# EasyEDA Pro project ProPrj_#第十届立创电赛#第十届立创电赛-小智AI立创开发板_2025-12-12.epro

# Schematic Schematic1_2
Board Name: 1、R16N8基本对话板 v1.1; Create Date: 2025-08-15; Page Name: P1; Project Name: 25.05 ESP32小智AI设备; Schematic Name: Schematic1_1; Update Date: 2025-08-18; Company: 嘉立创EDA; Page Size: A4; Version: V1.0
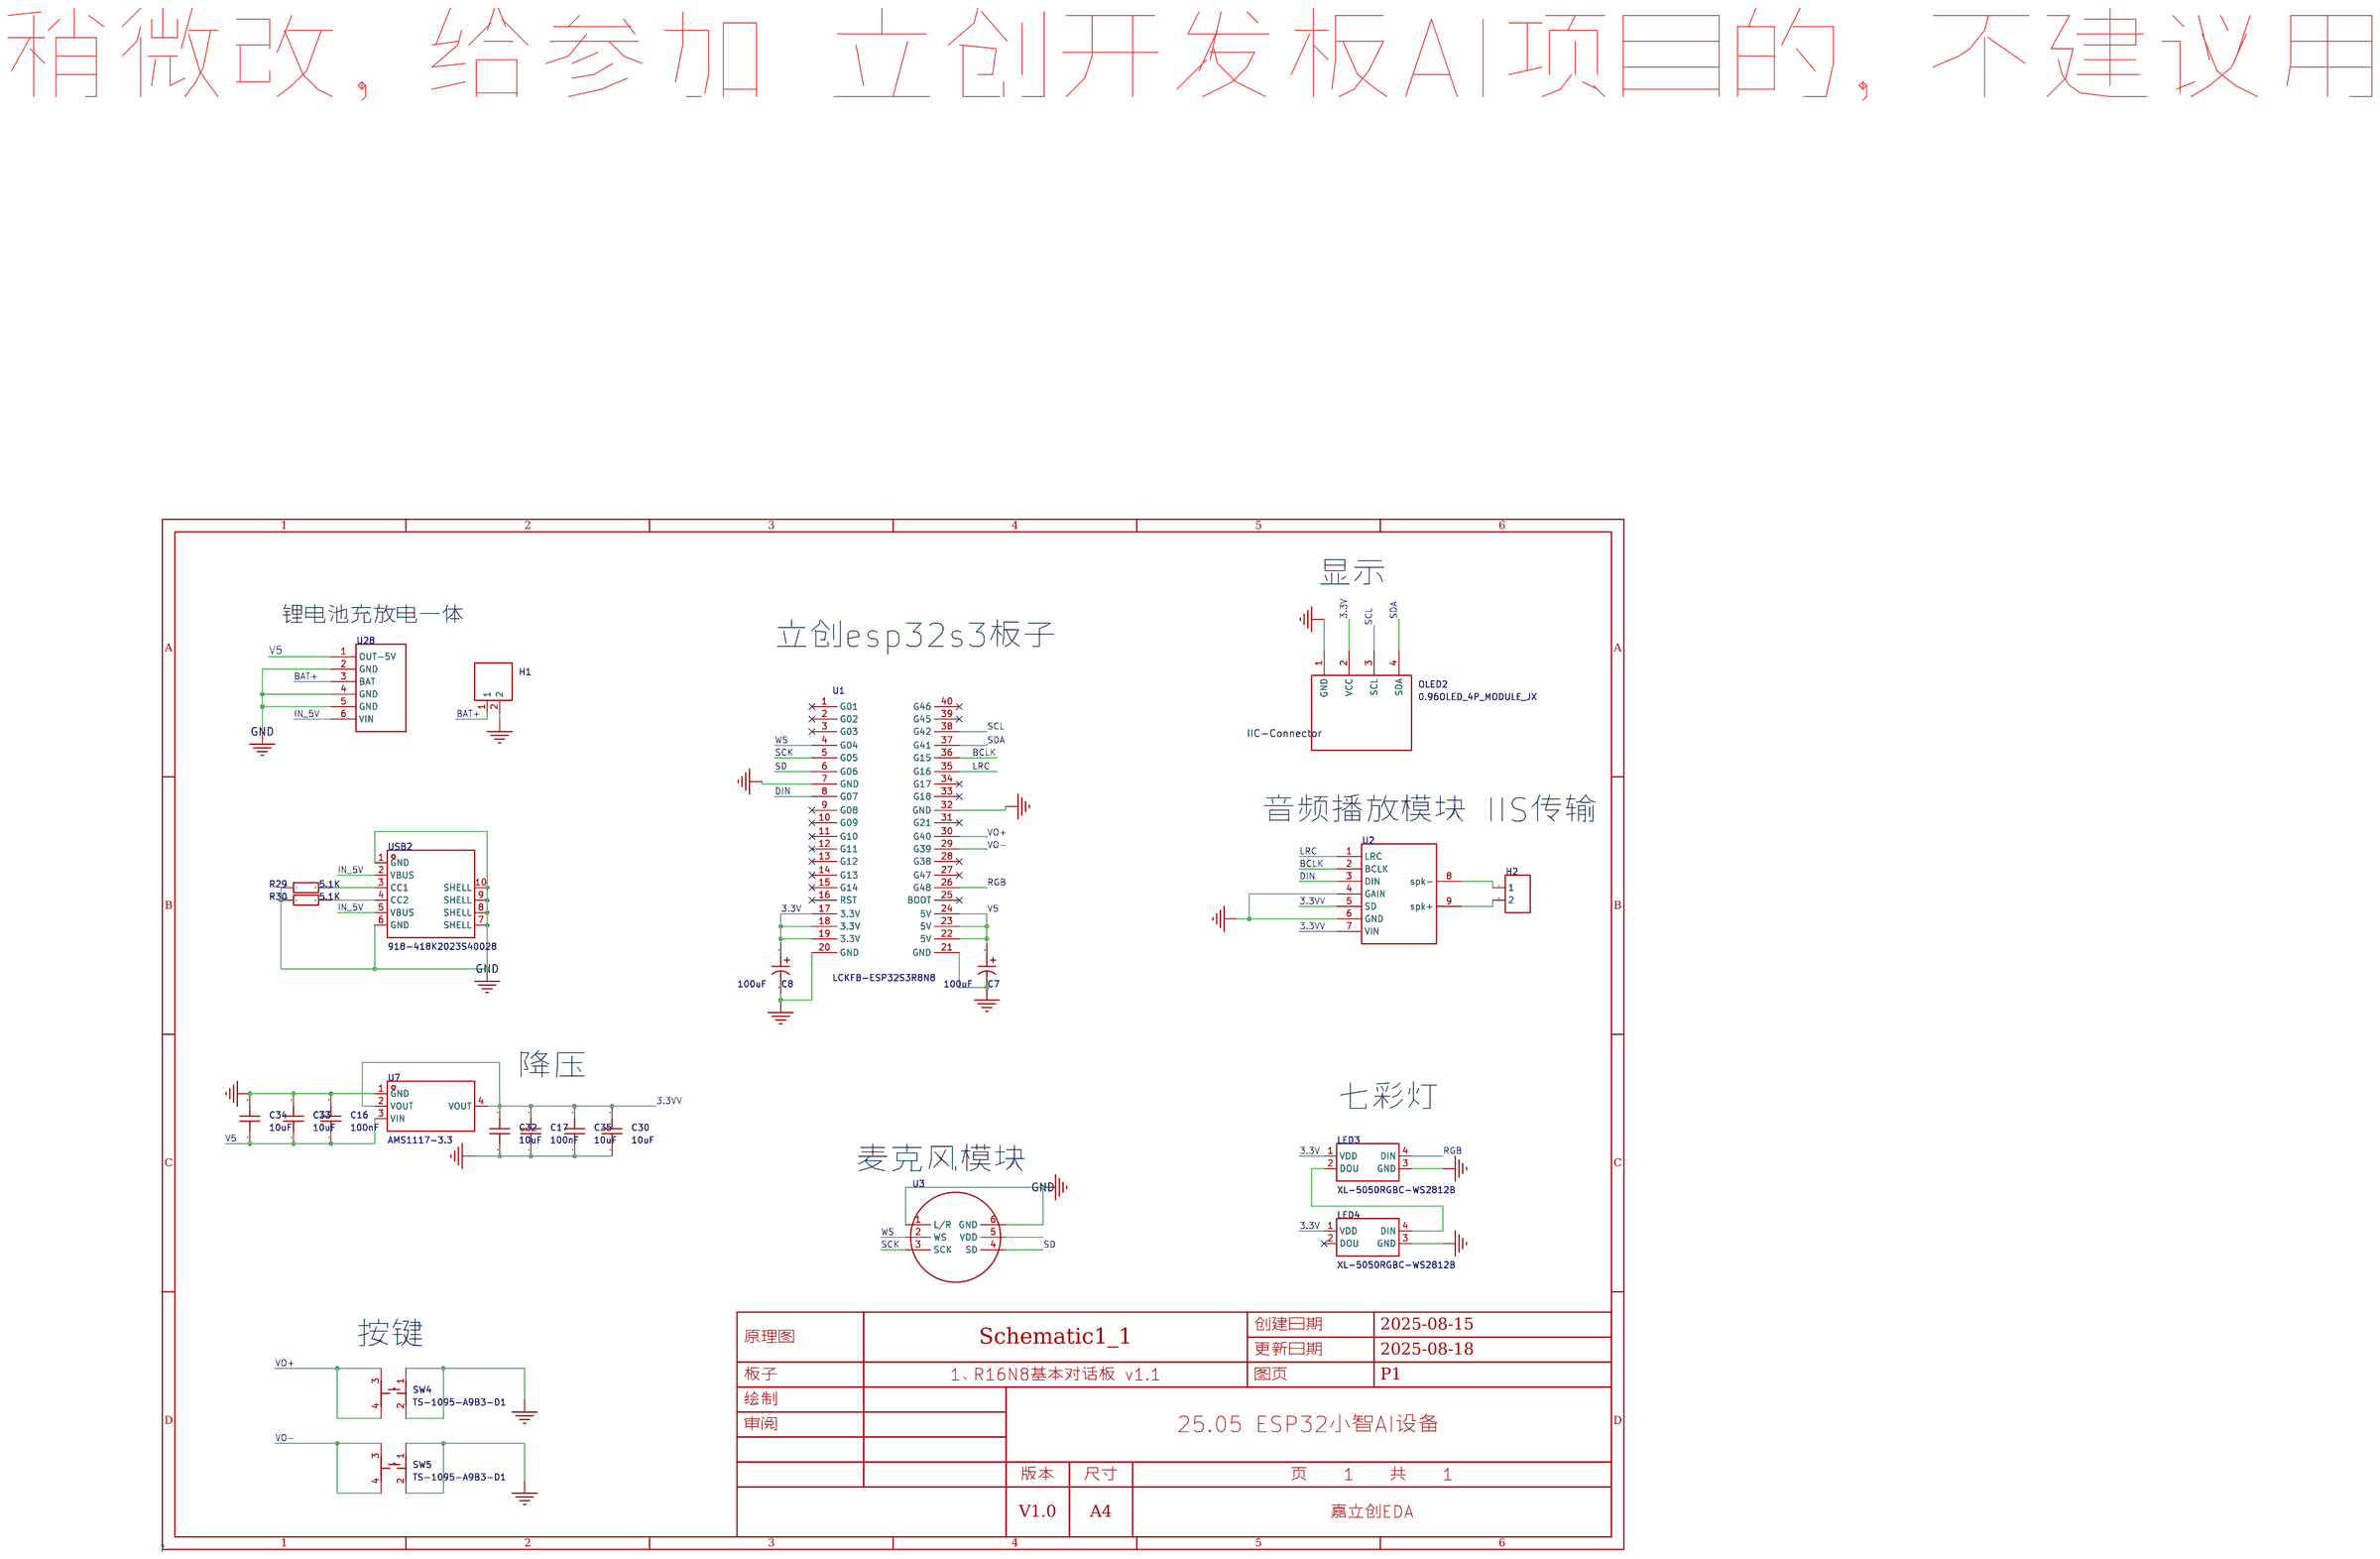
[diagram p0: schematic sheet]

## Parts
C7  100uF  [CAP-SMD_BD6.3-L6.6-W6.6-LS7.6-RD]
C8  100uF  [CAP-SMD_BD6.3-L6.6-W6.6-LS7.6-RD]
C16  100nF  [C0603]
C17  100nF  [C0603]
C30  10uF  [C0603]
C32  10uF  [C0603]
C33  10uF  [C0603]
C34  10uF  [C0603]
C35  10uF  [C0603]
H1  B-2100S02P-A110  [HDR-TH_2P-P2.54-V-M-1]
H2  -  [HDR-TH_2P-P2.54-V-F]
LED3  XL-5050RGBC-WS2812B  [LED-SMD_4P-L5.0-W5.0-BL_XL-5050RGBC]
LED4  XL-5050RGBC-WS2812B  [LED-SMD_4P-L5.0-W5.0-BL_XL-5050RGBC]
OLED2  0.96OLED_4P_MODULE_JX  [0.96OLED_4P]
R29  5.1K  [R0603]
R30  5.1K  [R0603]
SW4  TS-1095-A9B3-D1  [SW-TH_4P-L6.0-W6.0-P4.50-LS6.5]
SW5  TS-1095-A9B3-D1  [SW-TH_4P-L6.0-W6.0-P4.50-LS6.5]
U1  LCKFB-ESP32S3R8N8  [DIP-40_L20.32-W51.66-P2.54-LS15.24]
U2  -  [max98357a]
U3  -  [inmp441]
U7  AMS1117-3.3  [SOT-223-3_L6.5-W3.4-P2.30-LS7.0-BR]
U28  -  [MH-CD42_Module]
USB2  918-418K2023S40028  [USB-C-SMD_918-418K2023S40026]

## Library data of the parts
C7 C8 = RVT1H101M0607: 容值:100uF;精度:±20%;额定电压:50V;纹波电流:229mA@120Hz;; LCSC Part Name: 100uF ±20% 50V; Supplier Part: C3151829; Manufacturer: ROQANG(容强); Supplier Footprint: SMD,D6.3xL7.7mm; JLCPCB Part Class: 扩展库; Datasheet: https://atta.szlcsc.com/upload/public/pdf/source/20170325/1490427950282.pdf; Supplier: LCSC; Tolerance: ±20%; Rated Voltage: 50V; Ripple Current: 229mA@120Hz; φD: 6.3mm; L: 7.7mm; Lifetime @ Temp: 2000hrs@105℃; Operating Temperature: -40℃~+105℃
C16 C17 C30 C32-C35 = CAP_0603: Supplier Footprint: 0603
H1 = B-2100S02P-A110: 插针结构:1x2P;间距:2.54mm;行距:-;圆针/方针:-;安装方式:直插;排数:单排;总PIN位数:2P;额定电流:-;额定电压:-;配合针长度:6mm;塑高:2.54mm;端接针长度:3mm;触头材质:黄铜;触头镀层:-;工作温度:-40℃~+105℃;颜色:黑色;; LCSC Part Name: 1x2P 间距:2.54mm 直插; Supplier Part: C124375; Manufacturer: Ckmtw(灿科盟); Supplier Footprint: 插件,P=2.54mm; JLCPCB Part Class: Extended Part; Datasheet: https://atta.szlcsc.com/upload/public/pdf/source/20221019/2EE72DAC61CAA62C0A53546E211F9C15.pdf; Supplier: LCSC; Pin Structure: 1x2P; Pitch: 2.54mm; Mounting Type: 直插; Number of Rows: 单排; Number of Pins: 2P; Length of Mating Pin: 6mm; Insulation Height: 2.54mm; Length of End Connection Pin: 3mm; Contact Material: 黄铜; Operating Temperature: -40℃~+105℃; Color: 黑色
H2 = HDR-F_2.54_1x2P: Supplier Part: C49661; Supplier Footprint: 插件
LED3 LED4 = XL-5050RGBC-WS2812B: 5050七彩幻彩透明贴片LED灯珠 5050 幻彩透明四脚 ws2812B 内置驱动IC; Supplier Part: C2843785; Manufacturer: XINGLIGHT(成兴光); Supplier Footprint: SMD5050; JLCPCB Part Class: Extended Part; Datasheet: https://atta.szlcsc.com/upload/public/pdf/source/20240412/E1004CAA80592E31D08BFE019083806F.pdf; Supplier: LCSC
OLED2 = 0.96OLED_4P_MODULE_JX: Supplier Part: C9900004566; Supplier Footprint: 插件; JLCPCB Part Class: 扩展库; Supplier: LCSC
R29 R30 = Res_0603: Supplier Footprint: 0603
SW4 SW5 = TS-1095-A9B3-D1: 电路结构:单刀单掷;按钮形状:圆形按钮;安装方式:-;开关长度:6mm;开关宽度:6mm;开关高度:8mm;带灯:-;机械寿命:-;; LCSC Part Name: 轻触开关6*6*8.0mm插件四脚DIP圆柄黑柄250gf; Supplier Part: C493050; Manufacturer: Yuandi(元迪); JLCPCB Part Class: Extended Part; Datasheet: https://atta.szlcsc.com/upload/public/pdf/source/20200316/C493031_978ABBAA7BB5FD73504C6B696B546505.pdf; Supplier: LCSC; Circuit: 单刀单掷; Actuator Style: 圆形按钮; Switch Length: 6mm; Switch Width: 6mm; Switch Height: 8mm
U1 = LCKFB-ESP32S3R8N8: LCSC Part Name: 立创·ESP32S3R8N8 开发板; Supplier Part: C20626143; Manufacturer: 立创开发板; JLCPCB Part Class: Extended Part; Datasheet: https://atta.szlcsc.com/upload/public/pdf/source/20241206/8BAF30E9665AF2DA28B66306BACEE9A0.pdf; Supplier: LCSC
U2 = MAX98357A: MAX98357A I2S音频放大器模块
U3 = INMP441: INMP441 全向麦克风模块
U7 = AMS1117-3.3_C6186: 输出类型:固定;最大输入电压:-;输出电压:3.3V;最大输出电流:1A;电源纹波抑制比(PSRR):72dB@(120Hz);输出极性:正极;; LCSC Part Name: 输出3.3V 1A; Supplier Part: C6186; Manufacturer: AMS; Supplier Footprint: SOT-223; JLCPCB Part Class: 基础库; Datasheet: https://atta.szlcsc.com/upload/public/pdf/source/20180727/C6186_7A095716F0823C02F1997A905E26C086.pdf; Supplier: LCSC; Output Type: 固定; Output Voltage: 3.3V; MAX Output Current: 1A; Power Supply Rejection Ratio (PSRR): 72dB@(120Hz); Dropout Voltage: 1.3V@(800mA); Output Polarity: 正极; Number of Outputs: 1
U28 = mh-cd42: 5V/2A锂电池充放电一体模块，但按键、4led电量指示灯
USB2 = 918-418K2023S40028: 连接器类型:Type-C;标准:USB 3.1;公母:母;安装方式:卧贴;触点数量:6P;端口数量:1;额定电流 - 电源:-;工作温度范围:-25℃~+85℃;; LCSC Part Name: Type-C 母 卧贴 停产 停产; Supplier Part: C2763105; Manufacturer: 精拓金; Supplier Footprint: SMD; JLCPCB Part Class: 扩展库; Datasheet: https://atta.szlcsc.com/upload/public/pdf/source/20210526/C2763105_D24CC3EF9A00F9BD117EFBA5548A7E17.pdf; Supplier: LCSC; Connector Type: Type-C; Standard: USB 3.1; Gender: 母; Mounting Style: 卧贴; Number of Contacts: 6P; Number of Ports: 1; Operating Temperature Range: -25℃~+85℃

## Nets
3.3V: C8.1 LED3.1(VDD) LED4.1(VDD) OLED2.2(VCC) U1.17(3.3V) U1.18(3.3V) U1.19(3.3V)
3.3VV: C17.2 C30.2 C32.2 C35.2 U2.5(SD) U2.7(VIN) U7.2(VOUT) U7.4(VOUT)
GND: C7.2 C8.2 C16.2 C17.1 C30.1 C32.1 C33.2 C34.2 C35.1 H1.2 LED3.3(GND) LED4.3(GND) OLED2.1(GND) R29.1 R30.1 SW4.1 SW4.2 SW5.1 SW5.2 U1.7(GND) U1.20(GND) U1.21(GND) U1.32(GND) U2.4(GAIN) U2.6(GND) U3.1(L/R) U3.6(GND) U7.1(GND) U28.2(GND) U28.4(GND) U28.5(GND) USB2.1(GND) USB2.6(GND) USB2.7(SHELL) USB2.8(SHELL) USB2.9(SHELL) USB2.10(SHELL)
V5: C7.1 C16.1 C33.1 C34.1 U1.22(5V) U1.23(5V) U1.24(5V) U7.3(VIN) U28.1(OUT-5V)
BAT+: H1.1 U28.3(BAT)
BCLK: U1.36(G15) U2.2(BCLK)
DIN: U1.8(G07) U2.3(DIN)
IN_5V: U28.6(VIN) USB2.2(VBUS) USB2.5(VBUS)
LRC: U1.35(G16) U2.1(LRC)
RGB: LED3.4(DIN) U1.26(G48)
SCK: U1.5(G05) U3.3(SCK)
SCL: OLED2.3(SCL) U1.38(G42)
SD: U1.6(G06) U3.4(SD)
SDA: OLED2.4(SDA) U1.37(G41)
VO+: SW4.3 SW4.4 U1.30(G40)
VO-: SW5.3 SW5.4 U1.29(G39)
WS: U1.4(G04) U3.2(WS)
$1N4065: LED3.2(DOU) LED4.4(DIN)
$1N9820: R29.2 USB2.3(CC1)
$1N9821: R30.2 USB2.4(CC2)
$1N10523: H2.1 U2.8(spk-)
$1N10529: H2.2 U2.9(spk+)

Not connected (* = marked no-connect by the designer): LED4 2(DOU)*; U1 1(G01)* 2(G02)* 3(G03)* 9(G08)* 10(G09)* 11(G10)* 12(G11)* 13(G12)* 14(G13)* 15(G14)* 16(RST)* 25(BOOT)* 27(G47)* 28(G38)* 31(G21)* 33(G18)* 34(G17)* 39(G45)* 40(G46)*; U3 5(VDD)

## Notes on the sheet
- 稍微改，给参加 立创开发板AI项目的，不建议用
- 显示
- 锂电池充放电一体
- 立创esp32s3板子
- 音频播放模块 IIS传输
- 降压
- 七彩灯
- 麦克风模块
- 按键

# Board PCB-1.1_1
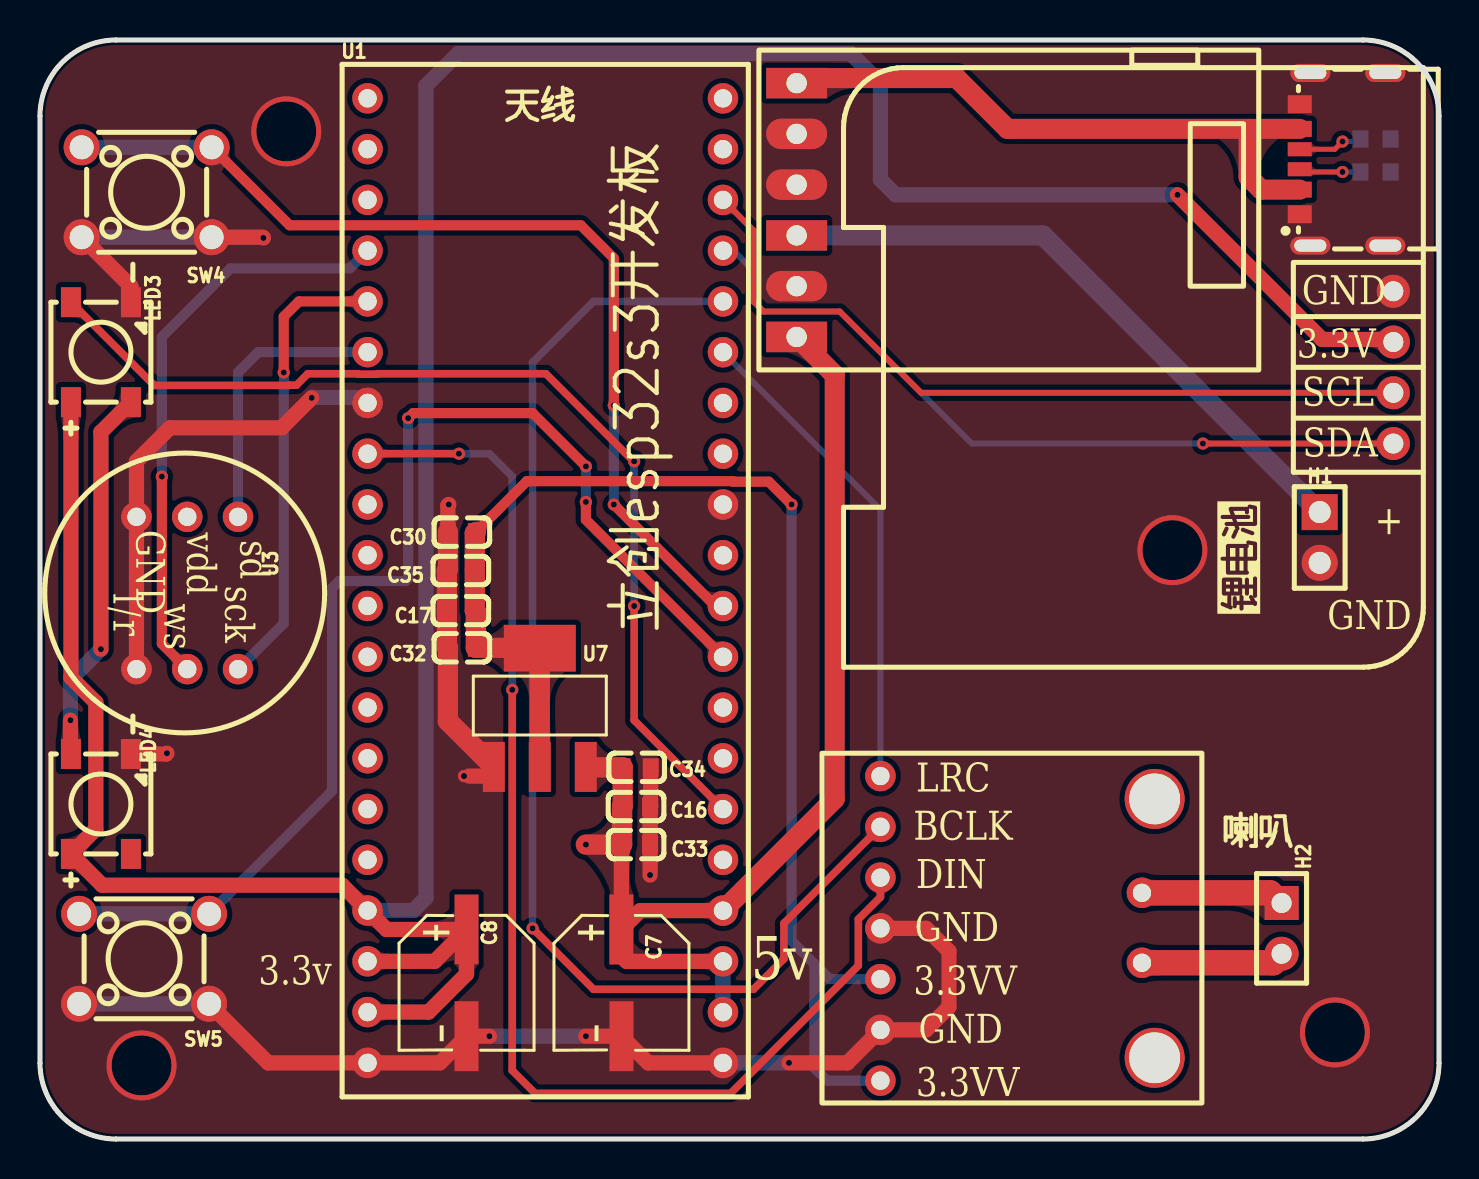
[diagram p1: board, top side]
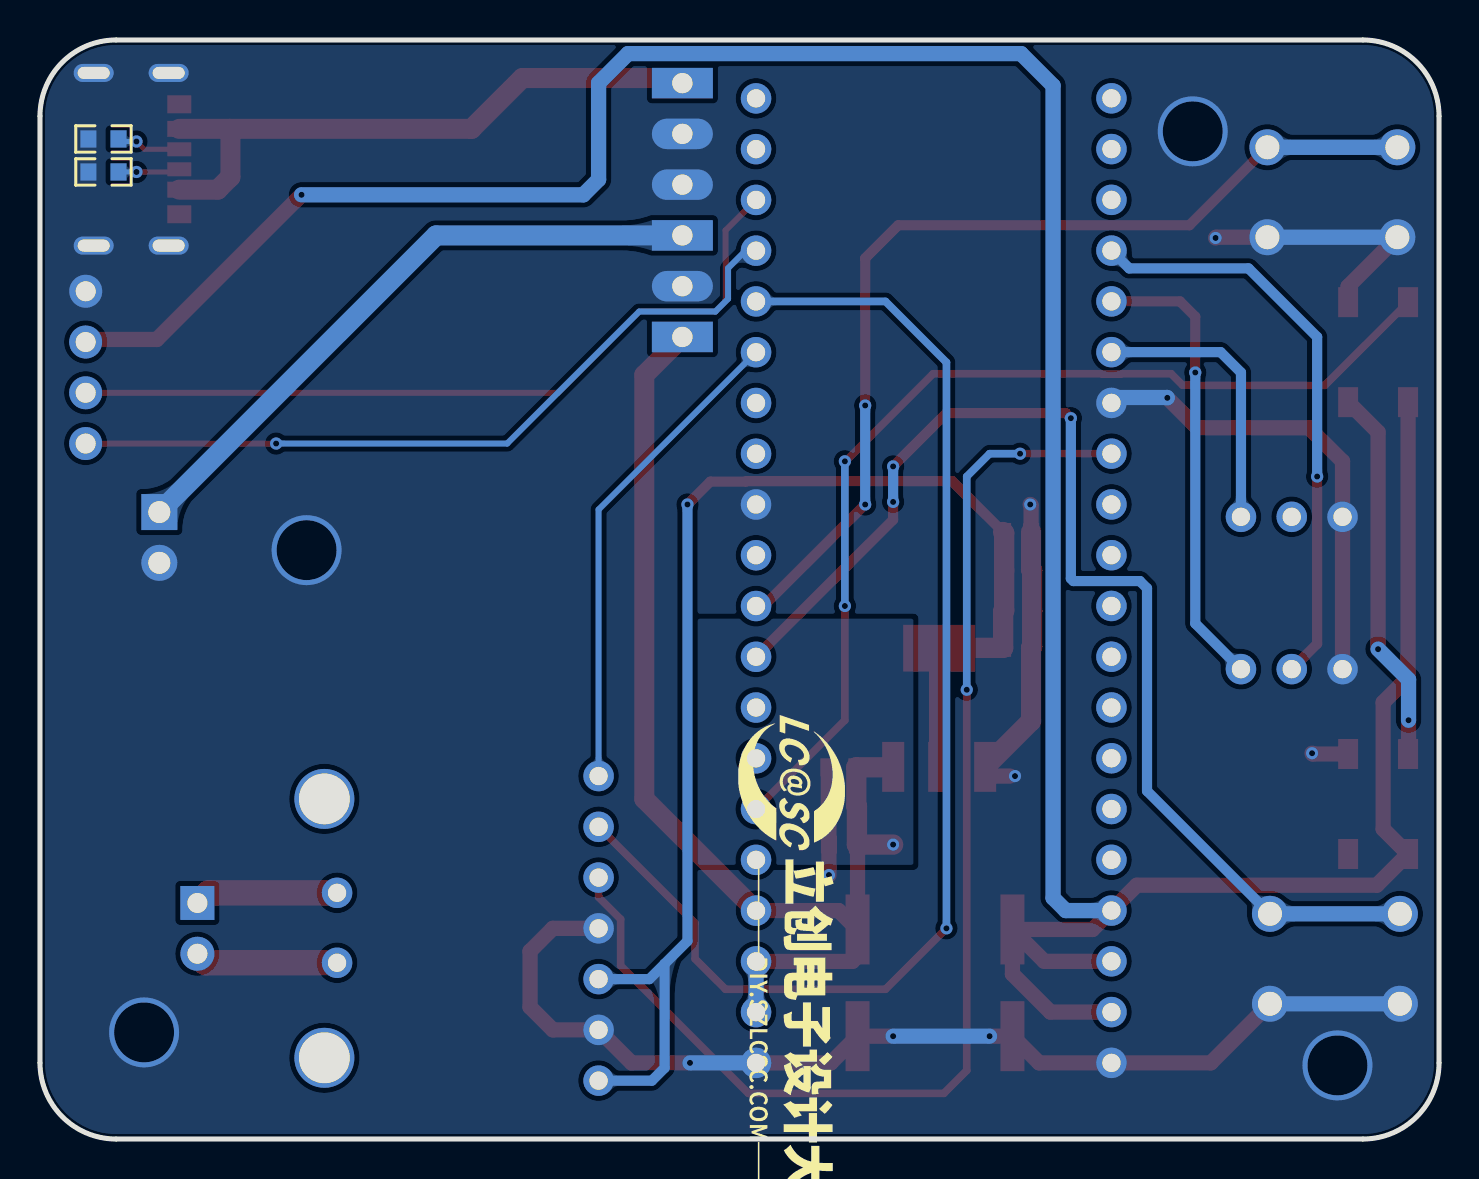
[diagram p2: board, bottom side, seen from below]

Outline 69.98 x 54.99 mm; copper layers: Top Layer, Bottom Layer. Coordinates in mm from the lower left corner of the outline.
Outline path: 0,51.18 0,3.81 arc(1.12,1.12) 3.81,0 66.17,0 arc(68.86,1.12) 69.98,3.81 69.98,51.18 arc(68.86,53.88) 66.17,54.99 3.81,54.99 arc(1.12,53.88) 0,51.18
Stack: Top Layer 0.035mm / Dielectric1 1.51mm FR4 er 4.5 / Bottom Layer 0.035mm

## Design rules (mm)
spacing copperThickness1oz (default): track to track 0.102, other pairs 0.152 to 0.3
spacing copperThickness2oz: track to track 0.203, other pairs 0.152 to 0.3
spacing Plane_innerPlane: track to track 0.102, other pairs 0.152 to 0.3
spacing Copper_copperRegion: track to track 0.102, other pairs 0.152 to 0.3
spacing Copper_copperRegion1: track to track 0.102, other pairs 0.152 to 0.3
track width copperThickness1oz (default): min 0.127, default 0.254, max 2.54
track width copperThickness2oz: min 0.203, default 0.254, max 2.54
differential pair differentialPair (default): width min 0.127, default 0.254, max 2.54; gap min 0.152, default 0.152

## Placement (name value [footprint] x y rotation side)
C7  100uF  [CAP-SMD_BD6.3-L6.6-W6.6-LS7.6-RD]  29.08 7.81 270 top
C8  100uF  [CAP-SMD_BD6.3-L6.6-W6.6-LS7.6-RD]  21.34 7.81 270 top
C16  100nF  [C0603]  29.81 16.64 0 top
C17  100nF  [C0603]  21.05 26.44 0 top
C30  10uF  [C0603]  21.1 30.37 0 top
C32  10uF  [C0603]  21.1 24.58 0 top
C33  10uF  [C0603]  29.81 14.73 0 top
C34  10uF  [C0603]  29.84 18.6 0 top
C35  10uF  [C0603]  21.05 28.45 0 top
H1  B-2100S02P-A110  [HDR-TH_2P-P2.54-V-M-1]  64.01 30.1 270 top
H2  -  [HDR-TH_2P-P2.54-V-F]  62.1 10.54 270 top
LED3  XL-5050RGBC-WS2812B  [LED-SMD_4P-L5.0-W5.0-BL_XL-5050RGBC]  3.05 39.37 0 top
LED4  XL-5050RGBC-WS2812B  [LED-SMD_4P-L5.0-W5.0-BL_XL-5050RGBC]  3.05 16.76 0 top
OLED2  0.96OLED_4P_MODULE_JX  [0.96OLED_4P]  67.69 38.61 270 top
R29  5.1K  [R0603]  66.8 48.39 180 bottom
R30  5.1K  [R0603]  66.8 50.04 180 bottom
SW4  TS-1095-A9B3-D1  [SW-TH_4P-L6.0-W6.0-P4.50-LS6.5]  5.33 47.37 180 top
SW5  TS-1095-A9B3-D1  [SW-TH_4P-L6.0-W6.0-P4.50-LS6.5]  5.21 9.02 180 top
U1  LCKFB-ESP32S3R8N8  [DIP-40_L20.32-W51.66-P2.54-LS15.24]  25.27 27.94 0 top
U2  -  [max98357a]  111 -8.13 0 top
U3  -  [inmp441]  39.62 96.66 90 top
U7  AMS1117-3.3  [SOT-223-3_L6.5-W3.4-P2.30-LS7.0-BR]  25 21.59 270 top
U28  -  [MH-CD42_Module]  50.55 47.75 180 top
USB2  918-418K2023S40028  [USB-C-SMD_918-418K2023S40026]  65.15 49.02 90 top

## Footprints (pads in the part's own frame, mm; a bottom-side part is the same pattern mirrored in y, then rotated)
0.96OLED_4P
  round 1.65 hole 1: 1(-3.81,-0.002) 2(-1.27,0.002) 3(1.27,0.002) 4(3.81,0.002)
C0603
  rect 0.8x0.9 smd: 1(-0.7,0) 2(0.7,0)
CAP-SMD_BD6.3-L6.6-W6.6-LS7.6-RD
  rect 3.5x1.2 smd: 1(-2.67,0) 2(2.67,0)
DIP-40_L20.32-W51.66-P2.54-LS15.24
  round 1.524 hole 0.914: 1(-8.889,24.131) 2(-8.889,21.591) 3(-8.889,19.052) 4(-8.889,16.512) 5(-8.889,13.972) 6(-8.889,11.431) 7(-8.889,8.892) 8(-8.889,6.351) 9(-8.889,3.812) 10(-8.889,1.272) 11(-8.889,-1.268) 12(-8.889,-3.808) 13(-8.889,-6.348) 14(-8.889,-8.889) 15(-8.889,-11.428) 16(-8.889,-13.969) 17(-8.889,-16.509) 18(-8.889,-19.049) 19(-8.889,-21.588) 20(-8.889,-24.128) 21(8.889,-24.131) 22(8.889,-21.591) 23(8.889,-19.052) 24(8.889,-16.512) 25(8.889,-13.972) 26(8.889,-11.431) 27(8.889,-8.892) 28(8.889,-6.351) 29(8.889,-3.812) 30(8.889,-1.272) 31(8.889,1.268) 32(8.889,3.808) 33(8.889,6.348) 34(8.889,8.889) 35(8.889,11.428) 36(8.889,13.969) 37(8.889,16.509) 38(8.889,19.049) 39(8.889,21.588) 40(8.889,24.128)
HDR-TH_2P-P2.54-V-F
  rect 1.7x1.7 hole 1: 1(-1.27,0)
  round 1.7 hole 1: 2(1.27,0)
HDR-TH_2P-P2.54-V-M-1
  rect 1.8x1.8 hole 1.1: 1(-1.27,0)
  round 1.8 hole 1.1: 2(1.27,0)
inmp441
  round 1.524 hole 0.914: 1(-73.152,34.798) 2(-73.152,32.258) 3(-73.152,29.718) 4(-65.532,29.718) 5(-65.532,32.258) 6(-65.532,34.798)
LED-SMD_4P-L5.0-W5.0-BL_XL-5050RGBC
  rect 1x1.5 smd: 1(-1.5,-2.5) 2(1.5,-2.5) 3(1.5,2.5) 4(-1.5,2.5)
max98357a
  round 3 hole 2.54: (-55.245,25.146) (-55.245,12.192)
  round 1.524 hole 0.914: 1(-68.961,26.289) 2(-68.961,23.749) 3(-68.961,21.209) 4(-68.961,18.669) 5(-68.961,16.129) 6(-68.961,13.589) 7(-68.961,11.049) 8(-55.88,20.447) 9(-55.88,16.947)
MH-CD42_Module
  rect 3.048x1.524 hole 1.016: 1(12.7,7.62) 3(12.7,2.54) 6(12.7,-5.08)
  oval 3.048x1.524 hole 1.016: 2(12.7,5.08) 4(12.7,0) 5(12.7,-2.54)
R0603
  rect 0.806x0.864 smd: 1(-0.753,0) 2(0.753,0)
SOT-223-3_L6.5-W3.4-P2.30-LS7.0-BR
  rect 2.5x1.1 smd: 1(2.97,-2.3) 2(2.97,0) 3(2.97,2.3)
  rect 2.34x3.6 smd: 4(-2.97,0)
SW-TH_4P-L6.0-W6.0-P4.50-LS6.5
  round 1.8 hole 1.2: 1(-3.25,2.25) 2(3.25,2.25) 3(-3.25,-2.25) 4(3.25,-2.25)
USB-C-SMD_918-418K2023S40026
  rect 0.9x1.2 smd: 1(-2.75,2.14) 6(2.75,2.14)
  rect 0.8x1.2 smd: 2(-1.52,2.14) 5(1.52,2.14)
  rect 0.7x1.2 smd: 3(-0.5,2.14) 4(0.5,2.14)
  oval 0.9x2 hole 0.6x1.6: 7(4.32,1.61) 8(4.32,-2.14) 9(-4.32,-2.14) 10(-4.32,1.61)

## Nets
As in the schematic.

Pads without a net: LED4 2; U1 1 2 3 9 10 11 12 13 14 15 16 25 27 28 31 33 34 39 40

## Via types
v1: diameter 0.61, hole 0.305, Top Layer to Bottom Layer, 29 vias
v2: diameter 3.5, hole 3, Top Layer to Bottom Layer, 4 vias

## Routing (per net, layer and track width the routed paths; a pad name or vN(x,y) marks a point on that pad's centre or on a via; arc(x,y) is an arc through that point)
3.3V: length 160.3
  Top Layer w0.762: LED3.1 1.55,23.09 2.79,21.84 2.79,15.51 LED4.1 3.11,12.7 15.12,12.7 U1.17 17.33,10.48 C8.1 ; C8.1 19.74,8.89 U1.18 ; C8.1 21.34,8.25 19.43,6.35 U1.19 ; v1(56.9,47.24) 64.14,40 67.57,40 OLED2.2
  Bottom Layer w0.762: v1(56.9,47.24) 42.8,47.24 42.04,48.01 42.04,52.83 40.56,54.31 20.91,54.31 19.3,52.7 19.3,12.06 18.67,11.43 U1.17
3.3VV: length 68.2
  Top Layer w0.508: v1(37.59,31.75) 36.45,32.89 34.67,32.89 34.65,32.92 24.35,32.92 C30.2
  Top Layer w1.016: C30.2 21.75,30.32 C35.2 C17.2 21.8,26.39 C32.2 24.98,24.58 U7.4 U7.2
  Bottom Layer w0.508: U2.5 39.5,8 38.73,8.76 ; 38.73,8.76 37.59,9.91 v1(37.59,31.75) ; 38.73,8.76 38.73,3.56 39.37,2.92 U2.7
GND: length 113.3
  Top Layer w0.762: SW4.1 11.14,45.12 v1(11.18,45.08) ; U2.4 44.32,10.54 45.47,9.4 45.47,6.6 44.32,5.46 U2.6 40.39,3.81 v1(37.46,3.81) ; U1.21 30.42,3.81 C7.2 v1(27.3,5.14) ; 22.7,18.62 22.24,18.16 21.46,18.16 ; LED3.3 4.55,42.66 SW4.2 ; LED4.3 6.31,19.26 v1(6.35,19.3) ; C30.1 20.4,31.71 v1(20.45,31.75) ; v1(30.51,13.21) C33.2 C16.2 30.55,16.67 C34.2 ; v1(13.59,37.08) 12.09,35.59 6.5,35.59 4.83,33.91 4.83,23.51 ; v1(22.48,5.14) C8.2 20,3.81 U1.20 11.41,3.81 SW5.1
  Top Layer w1.016: C30.1 20.4,28.5 C35.1 C17.1 20.35,24.63 C32.1 20.4,20.92 22.7,18.62
  Bottom Layer w0.762: SW5.2 SW5.1 ; v1(13.59,37.08) 13.61,37.1 16.11,37.1 16.38,36.83 ; U1.21 37.46,3.81 ; v1(22.48,5.14) v1(27.3,5.14) ; SW4.2 SW4.1
  vias: v1(21.21,18.16) v2(5.08,3.68) v2(12.32,50.42) v2(56.64,29.46) v2(64.77,5.33)
V5: length 58.1
  Top Layer w0.762: C33.1 29.08,14.7 C7.1 ; U1.23 29.34,8.89 29.08,9.14 C7.1 ; U1.24 30.03,11.43 C7.1
  Top Layer w1: U1.24 39.75,17.02 39.75,38.23 37.85,40.13
  Top Layer w1.016: U7.3 27.32,18.6 C34.1 29.14,16.67 C16.1 C33.1 v1(27.3,14.73)
  Bottom Layer w0.762: U1.22 U1.23
BAT+: length 31.9
  Bottom Layer w1: 37.85,45.21 50.17,45.21 H1.1
BCLK: length 62.2
  Top Layer w0.381: U2.2 37.21,10.8 37.21,9.02 35.69,7.49 27.69,7.49 v1(24.64,10.54)
  Bottom Layer w0.381: U1.36 27.68,41.91 24.64,38.86 v1(24.64,10.54)
DIN: length 62.7
  Top Layer w0.381: U2.3 42.04,12.1 40.93,11 40.93,8.67 34.54,2.29 24.77,2.29 23.62,3.43 v1(23.62,22.48) ; 20.95,34.29 U1.8
  Bottom Layer w0.381: v1(23.62,22.48) 23.62,33.15 22.48,34.29 v1(20.95,34.29)
IN_5V: length 31.6
  Top Layer w1: 60.48,50.54 60.45,50.51 60.45,48.13 61.08,47.5 USB2.2 ; 60.48,50.54 USB2.5 ; 60.48,50.54 48.39,50.54 45.85,53.09 38.1,53.09 37.85,52.83
LRC: length 24.5
  Bottom Layer w0.3: U2.1 42.04,31.49 U1.35
RGB: length 51.2
  Top Layer w0.381: v1(29.72,26.67) 29.72,20.95 U1.26 ; LED3.4 5.71,37.71 12.46,37.71 12.47,37.72 12.83,37.72 13.4,38.29 15.9,38.29 15.93,38.27 16.84,38.27 16.87,38.29 25.31,38.29 29.69,33.91 v1(29.72,33.91)
  Bottom Layer w0.381: v1(29.72,33.91) v1(29.72,26.67)
SCK: length 23.1
  Top Layer w0.508: U1.5 12.96,41.91 12.19,41.15 v1(12.19,38.35)
  Bottom Layer w0.508: v1(12.19,38.35) 12.19,25.8 9.91,23.51
SCL: length 39.6
  Top Layer w0.3: OLED2.3 44.07,37.34 40.01,41.4 36.2,41.4 35.69,41.91 35.69,45.46 U1.38
SD: length 14.1
  Bottom Layer w0.508: U1.6 10.92,39.37 9.91,38.35 9.91,31.13
SDA: length 38.4
  Top Layer w0.3: v1(58.17,34.8) OLED2.4
  Bottom Layer w0.3: v1(58.17,34.8) 46.61,34.8 40.01,41.4 36.2,41.4 35.56,42.04 35.56,43.57 34.68,44.45 U1.37
VO+: length 48.8
  Top Layer w0.508: SW4.3 12.48,45.72 27.05,45.72 28.7,44.07 v1(28.7,36.7) ; v1(28.7,31.75) 33.78,26.67 U1.30
  Bottom Layer w0.508: v1(28.7,31.75) v1(28.7,36.7)
  Bottom Layer w0.762: SW4.4 SW4.3
VO-: length 59.8
  Top Layer w0.508: U1.29 27.3,30.99 v1(27.3,31.88) ; v1(18.42,36.07) 18.67,36.32 24.64,36.32 v1(27.3,33.66)
  Bottom Layer w0.508: SW5.3 14.61,17.42 14.61,27.56 14.96,27.92 18.29,27.92 18.42,28.05 v1(18.42,36.07) ; v1(27.3,31.88) v1(27.3,33.66)
  Bottom Layer w0.762: SW5.4 SW5.3
WS: length 29.2
  Top Layer w0.508: v1(6.1,33.15) 6.1,24.78 U3.2
  Bottom Layer w0.508: v1(6.1,33.15) 6.1,40.13 9.52,43.56 15.49,43.56 U1.4
$1N4065: length 18.9
  Top Layer w0.762: v1(3.05,24.51) 3.05,35.37 LED3.2 ; LED4.4 1.52,19.29 v1(1.52,20.95)
  Bottom Layer w0.762: v1(3.05,24.51) 1.52,22.99 v1(1.52,20.95)
$1N9820: length 3.1
  Top Layer w0.254: USB2.3 63.15,48.39 v1(65.15,48.39)
  Bottom Layer w0.254: R29.2 v1(65.15,48.39)
$1N9821: length 3.3
  Top Layer w0.254: v1(65.15,49.91) 64.76,49.52 USB2.4
  Bottom Layer w0.254: v1(65.15,49.91) 65.92,49.91 R30.2
$1N10523: length 7.2
  Top Layer w1.27: U2.8 61.52,12.32 62.1,11.74
$1N10529: length 7.2
  Top Layer w1.27: 62.1,9.24 61.68,8.82 U2.9

## Copper pours and planes (outline as drawn; the poured copper is in the pictures)
GND on Top Layer: -1.27,56.13 72.39,56.13 72.39,-1.9 -1.27,-1.9
GND on Bottom Layer: -8.13,58.93 75.95,58.93 75.95,-2.79 -8.13,-2.79
GND on Bottom Layer: -4.32,58.8 74.42,58.8 74.42,-2.16 -4.32,-2.16
V5 on Bottom Layer: 26.29,26.03 37.08,26.03 37.08,13.72 26.29,13.72

Small or netless copper shapes (teardrops, artwork), in the pictures only: 87 on Top Layer, 44 on Bottom Layer

## Text on the board
Top Silkscreen Layer: 3.3v | 天线 | BCLK | 3.3VV | GND | LRC | DIN | 喇叭 | 3.3V | SCL | SDA | + | 锂电池 | l/r | ws | vdd | sck | sd | 立创esp32s3开发板 | 5v
